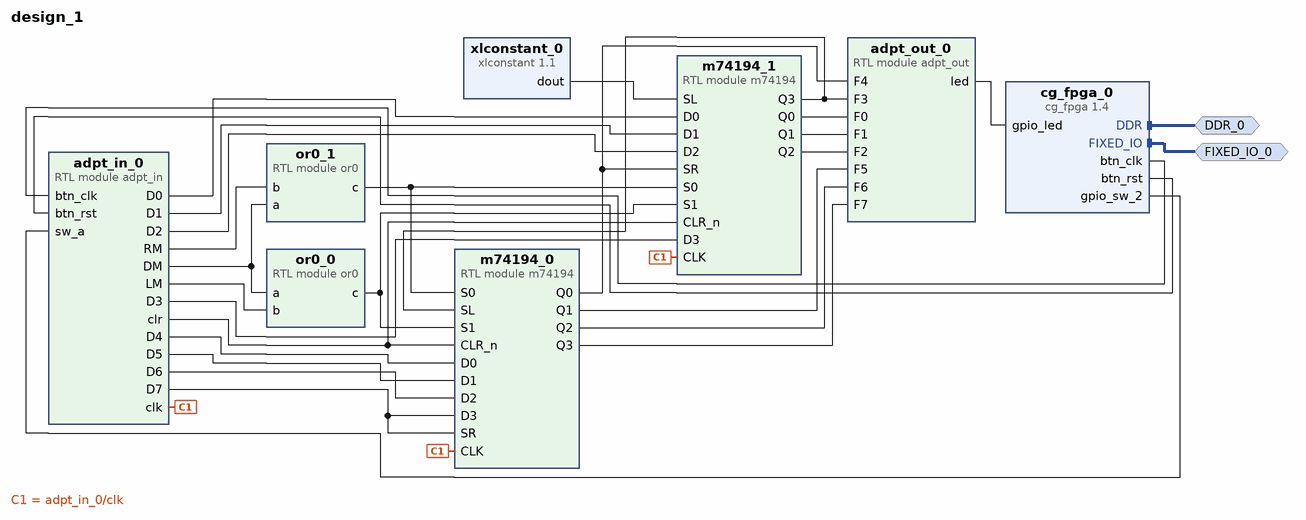
[diagram p0: block diagram of the top level]
# Vivado block design design_1, xc7z020clg400-1, Vivado 2024.2
create_bd_design design_1

create_bd_intf_port -mode Master -vlnv xilinx.com:display_processing_system7:fixedio_rtl:1.0 FIXED_IO_0
create_bd_intf_port -mode Master -vlnv xilinx.com:interface:ddrx_rtl:1.0 DDR_0

create_bd_cell -type ip -vlnv educg.net:user:cg_fpga:1.4 cg_fpga_0
create_bd_cell -type module -reference adpt_in adpt_in_0
create_bd_cell -type module -reference m74194 m74194_0
create_bd_cell -type module -reference m74194 m74194_1
create_bd_cell -type module -reference adpt_out adpt_out_0
create_bd_cell -type module -reference or0 or0_0
create_bd_cell -type module -reference or0 or0_1
create_bd_cell -type ip -vlnv xilinx.com:ip:xlconstant:1.1 xlconstant_0
set_property -dict {CONFIG.CONST_VAL 0} [get_bd_cells xlconstant_0]

# ---- connections ----

connect_bd_intf_net [get_bd_intf_ports DDR_0] [get_bd_intf_pins cg_fpga_0/DDR]
connect_bd_intf_net [get_bd_intf_ports FIXED_IO_0] [get_bd_intf_pins cg_fpga_0/FIXED_IO]
connect_bd_net [get_bd_pins adpt_in_0/D0] [get_bd_pins m74194_1/D0]
connect_bd_net [get_bd_pins adpt_in_0/D1] [get_bd_pins m74194_1/D1]
connect_bd_net [get_bd_pins adpt_in_0/D2] [get_bd_pins m74194_1/D2]
connect_bd_net [get_bd_pins adpt_in_0/D3] [get_bd_pins m74194_1/D3]
connect_bd_net [get_bd_pins adpt_in_0/D4] [get_bd_pins m74194_0/D0]
connect_bd_net [get_bd_pins adpt_in_0/D5] [get_bd_pins m74194_0/D1]
connect_bd_net [get_bd_pins adpt_in_0/D6] [get_bd_pins m74194_0/D2]
connect_bd_net [get_bd_pins adpt_in_0/D7] [get_bd_pins m74194_0/D3] [get_bd_pins m74194_0/SR]
connect_bd_net [get_bd_pins adpt_in_0/DM] [get_bd_pins or0_0/a] [get_bd_pins or0_1/a]
connect_bd_net [get_bd_pins adpt_in_0/LM] [get_bd_pins or0_0/b]
connect_bd_net [get_bd_pins adpt_in_0/RM] [get_bd_pins or0_1/b]
connect_bd_net [get_bd_pins adpt_in_0/clk] [get_bd_pins m74194_1/CLK] [get_bd_pins m74194_0/CLK]
connect_bd_net [get_bd_pins adpt_in_0/clr] [get_bd_pins m74194_1/CLR_n] [get_bd_pins m74194_0/CLR_n]
connect_bd_net [get_bd_pins adpt_out_0/led] [get_bd_pins cg_fpga_0/gpio_led]
connect_bd_net [get_bd_pins cg_fpga_0/btn_clk] [get_bd_pins adpt_in_0/btn_clk]
connect_bd_net [get_bd_pins cg_fpga_0/btn_rst] [get_bd_pins adpt_in_0/btn_rst]
connect_bd_net [get_bd_pins cg_fpga_0/gpio_sw_2] [get_bd_pins adpt_in_0/sw_a]
connect_bd_net [get_bd_pins m74194_0/Q0] [get_bd_pins adpt_out_0/F4] [get_bd_pins m74194_1/SR]
connect_bd_net [get_bd_pins m74194_0/Q1] [get_bd_pins adpt_out_0/F5]
connect_bd_net [get_bd_pins m74194_0/Q2] [get_bd_pins adpt_out_0/F6]
connect_bd_net [get_bd_pins m74194_0/Q3] [get_bd_pins adpt_out_0/F7]
connect_bd_net [get_bd_pins m74194_1/Q0] [get_bd_pins adpt_out_0/F0]
connect_bd_net [get_bd_pins m74194_1/Q1] [get_bd_pins adpt_out_0/F1]
connect_bd_net [get_bd_pins m74194_1/Q2] [get_bd_pins adpt_out_0/F2]
connect_bd_net [get_bd_pins m74194_1/Q3] [get_bd_pins adpt_out_0/F3] [get_bd_pins m74194_0/SL]
connect_bd_net [get_bd_pins or0_0/c] [get_bd_pins m74194_0/S1] [get_bd_pins m74194_1/S1]
connect_bd_net [get_bd_pins or0_1/c] [get_bd_pins m74194_0/S0] [get_bd_pins m74194_1/S0]
connect_bd_net [get_bd_pins xlconstant_0/dout] [get_bd_pins m74194_1/SL]

validate_bd_design
save_bd_design
